# Altium project My_Forecaster.PrjPcb
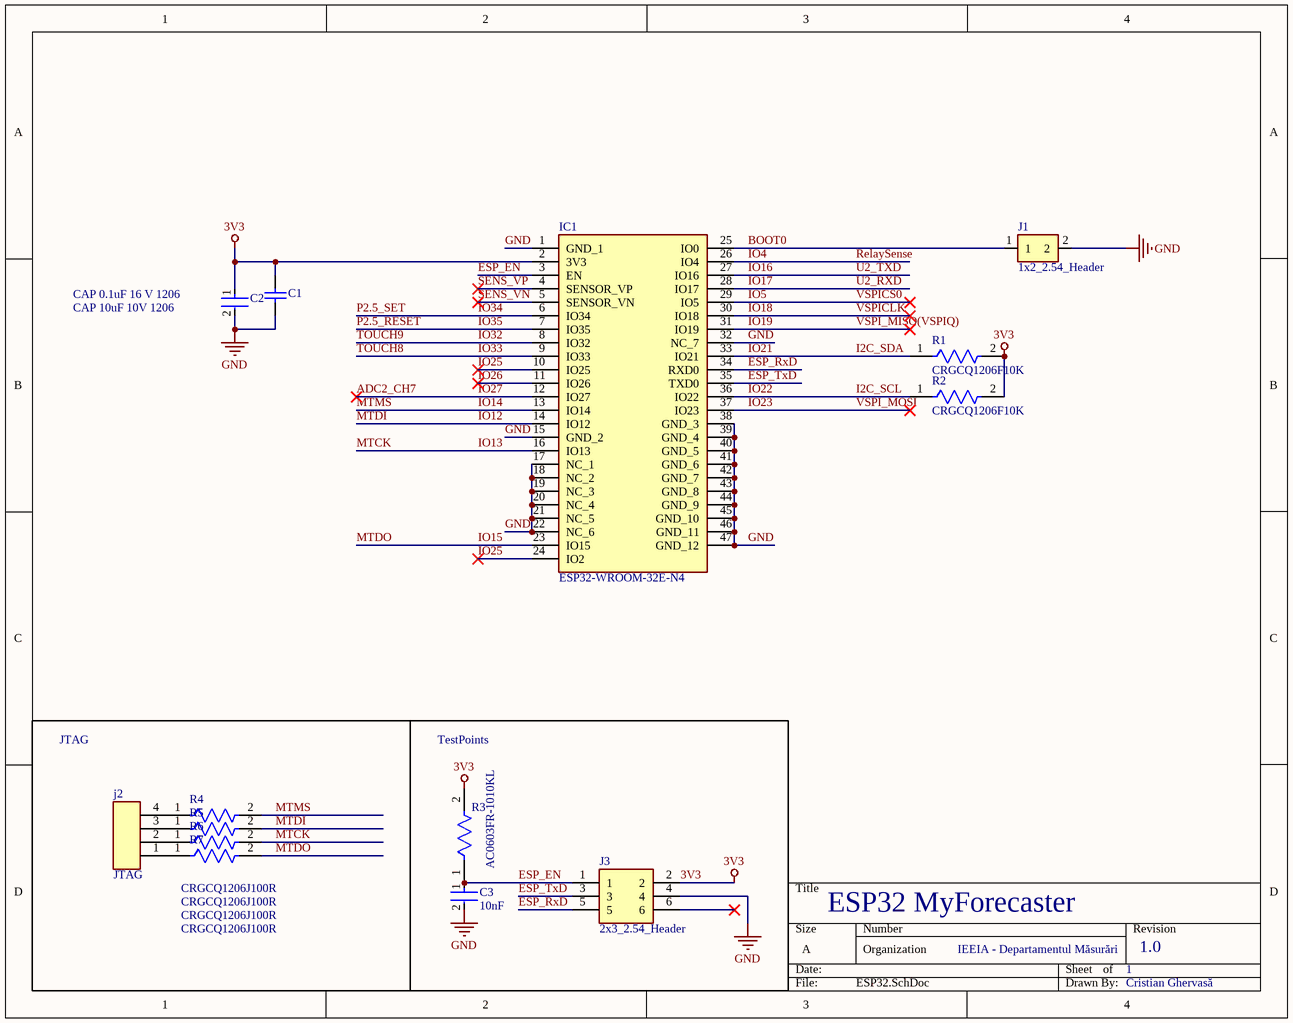
[diagram p0: ESP32.SchDoc]
Revision: 1.0; Organization: IEEIA - Departamentul Măsurări; DrawnBy: Cristian Ghervasă
4 sheets, 41 parts. Net scope: global (net labels, ports and power ports of the same name join across sheets).
Board file: My_Forecaster.PcbDoc
Sheets:
  ESP32.SchDoc
  Communication.SchDoc
  Battery_Circuit.SchDoc
  PowerPlant.SchDoc

## Sheet ESP32.SchDoc
size A; SheetNumber: 1; SheetTotal: 4

### Parts
C1  CAP 10uF 10V 1206  [CAPC1206(3216)190_N]
C2  CAP 0.1uF 16 V 1206  [FP-C1206C-EB-MFG]
C3  10nF  [FP-CL10-IPC_B]
IC1  ESP32-WROOM-32E-N4  [ESP32WROOM32EN4]
J1  1x2_2.54_Header  [1x2_2.54_Header]
j2  JTAG  [1x4_2.54_Header]
J3  2x3_2.54_Header  [2x3_2.54_Header]
R1  CRGCQ1206F10K  [FP-CRGCQ1206-IPC_C]
R2  CRGCQ1206F10K  [FP-CRGCQ1206-IPC_C]
R3  AC0603FR-1010KL  [FP-AC0603-IPC_B]
R4  CRGCQ1206J100R  [FP-CRGCQ1206-IPC_C]
R5  CRGCQ1206J100R  [FP-CRGCQ1206-IPC_C]
R6  CRGCQ1206J100R  [FP-CRGCQ1206-IPC_C]
R7  CRGCQ1206J100R  [FP-CRGCQ1206-IPC_C]

### Blocks framed on the sheet
JTAG: j2 R4-R7

### Nets
3V3: C1.2 C2.1 IC1.2(3V3) J3.2 R1.2 R2.2 R3.2
GND: C1.1 C2.2 C3.2 IC1.1(GND_1) IC1.15(GND_2) IC1.17(NC_1) IC1.18(NC_2) IC1.19(NC_3) IC1.20(NC_4) IC1.21(NC_5) IC1.22(NC_6) IC1.32(NC_7) IC1.38(GND_3) IC1.39(GND_4) IC1.40(GND_5) IC1.41(GND_6) IC1.42(GND_7) IC1.43(GND_8) IC1.44(GND_9) IC1.45(GND_10) IC1.46(GND_11) IC1.47(GND_12) J1.2 J3.4
ADC2_CH7: IC1.12(IO27)  [also labelled IO27]
BOOT0: IC1.25(IO0) J1.1
ESP_EN: C3.1 IC1.3(EN) J3.1 R3.1
ESP_RxD: IC1.34(RXD0) J3.5
ESP_TxD: IC1.35(TXD0) J3.3
I2C_SCL: IC1.36(IO22) R2.1  [also labelled IO22]
I2C_SDA: IC1.33(IO21) R1.1  [also labelled IO21]
IO4: IC1.26(IO4)  [also labelled RelaySense]
IO5: IC1.29(IO5)  [also labelled VSPICS0]
IO12: IC1.14(IO12) R5.2  [also labelled MTDI]
IO13: IC1.16(IO13) R6.2  [also labelled MTCK]
IO14: IC1.13(IO14) R4.2  [also labelled MTMS]
IO15: IC1.23(IO15) R7.2  [also labelled MTDO]
IO16: IC1.27(IO16)  [also labelled U2_TXD]
IO17: IC1.28(IO17)  [also labelled U2_RXD]
IO18: IC1.30(IO18)  [also labelled VSPICLK]
IO19: IC1.31(IO19)  [also labelled VSPI_MISO(VSPIQ)]
IO23: IC1.37(IO23)  [also labelled VSPI_MOSI]
IO25: IC1.10(IO25) IC1.24(IO2)
IO26: IC1.11(IO26)
IO32: IC1.8(IO32)  [also labelled TOUCH9]
IO33: IC1.9(IO33)  [also labelled TOUCH8]
IO34: IC1.6(IO34)  [also labelled P2.5_SET]
IO35: IC1.7(IO35)  [also labelled P2.5_RESET]
SENS_VN: IC1.5(SENSOR_VN)
SENS_VP: IC1.4(SENSOR_VP)
Netj2_1: j2.1 R7.1
Netj2_2: j2.2 R6.1
Netj2_3: j2.3 R5.1
Netj2_4: j2.4 R4.1

Not connected (* = marked no-connect by the designer): J3 6*

### Notes on the sheet
- TestPoints
- ESP32 MyForecaster
- Organization

### Library data of the parts
C1 = CMP-1037-04966-1: CAP 10uF 10V ±5% 1206 (3216 Metric) Thickness 1.9mm SMD; Case-Metric: 3216; Case-EIA: 1206; Tolerance: Â±5%; Max Thickness: 1.9 mm; Value: 10uF; Rated Voltage: 10 V; Technology: SMT
C2 = CMP-03020-018021-2: C1206 0.10 μF X7R 10.00% 16 V; Manufacturer Part Number: C1206C104K4RACAUTO; Manufacturer: KEMET; Automotive Grade: Grade 0; Tolerance: 0.1; Temperature Coefficient: 15%; Material: Ceramic; Capacitance: 0.10 μF; Value: 0.10 μF; Voltage Rating: 16 V; Package: C1206C-EB; Device Class L2: Capacitors; ComponentLink2URL: https://content.kemet.com/datasheets/KEM_C1007_X8R_ULTRA_150C_SMD.pdf; RoHS: TRUE; Height: 0.88mm; Device Class L1: Passive Components; Temperature Range Low: -55°C; Category: Cap; Octopart: https://octopart.com/c1206c104k4racauto-kemet-95437231; Lead Free: Yes; Temperature Characteristic: X7R; Temperature Range High: +150°C; Device Class L3: Ceramic Capacitors; Temperature: -55°C to +150°C; Ipc Land Pattern Name: CAPC320160X78; Automotive: Yes; ComponentLink2Description: Datasheet
C3 = CMP-13271-004285-1: Cap Ceramic 10nF 25V X7R ±10% Pad SMD 0603 +125°C T/R; Voltage: 50V; Height: 0.8mm; Tolerance: 10%; Package Quantity: 4000; Width: 0.031inch; Case/Package: 0603; Thickness: 0.035inch; Capacitance: 10nF; Packaging: Tape and Reel; Min Operating Temperature: -55°C; RoHS Compliant: Yes; Voltage Rating: 25V; Case Code (Imperial): 0603; Radiation Hardening: No; Depth: 0.8mm; Series: CL; Contact Plating: Tin; Mount: Surface Mount; Construction: Flat; Case Code (Metric): 1608; Length: 1.6mm; Max Operating Temperature: 125°C; Dielectric: X7R
IC1 = ESP32-WROOM-32E-N4: Integrated Circuit; Manufacturer_Name: Espressif Systems; Datasheet Link: https://www.espressif.com/sites/default/files/documentation/esp32-wroom-32e_esp32-wroom-32ue_datasheet_en.pdf; Height: 3.25mm; Manufacturer_Part_Number: ESP32-WROOM-32E-N4; Mouser Part Number: 356-ESP32WRM32E132PH; Mouser Price/Stock: https://www.mouser.co.uk/ProductDetail/Espressif-Systems/ESP32-WROOM-32E-N4?qs=Li%252BoUPsLEnsPzTWsi%252BRMgQ%3D%3D
J1 = 1x2_2.54_Header: Connector
j2 = 1x4_2.54_Header: Connector
J3 = 2x3_2.54_Header: Connector; Manufacturer_Name: TE Connectivity; Manufacturer_Part_Number: 5-146254-3; Datasheet Link: https://4donline.ihs.com/images/VipMasterIC/IC/TYEL/TYEL-S-A0002895876/TYEL-S-A0002895876-1.pdf?hkey=52A5661711E402568146F3353EA87419; Height: 8.21mm; Mouser Part Number: 571-5-146254-3; Mouser Price/Stock: https://www.mouser.co.uk/ProductDetail/TE-Connectivity/5-146254-3?qs=bwpFY26eRVeBoCoMAqhLNw%3D%3D; Arrow Part Number: 5-146254-3; Arrow Price/Stock: https://www.arrow.com/en/products/5-146254-3/te-connectivity?utm_currency=USD&region=nac
R1 R2 = CMP-03211-010884-1: CRGCQ1206 10KΩ 0.25W 1% ±100ppm/°C 200V; Manufacturer: TE Connectivity; Tolerance: 0.01; Automotive Grade: Grade 913; Value: 10KΩ; Automotive: Yes; Temperature: -55°C to +155°C; RoHS: TRUE; Series: CRGCQ; Lead Free: Yes; Device Class L3: Chip SMD Resistors; Package: CRGCQ1206; ComponentLink2URL: https://www.te.com/commerce/DocumentDelivery/DDEController?Action=showdoc&DocId=Data+Sheet%7F1773204-3%7F1%7Fpdf%7FEnglish%7FENG_DS_1773204-3_1.pdf%7F4-2176347-922; Ipc Land Pattern Name: RESC310155X55; Composition: Thick Film; Voltage Rating: 200V; Device Class L1: Passive Components; Temperature Range Low: -55°C; Resistance: 10KΩ; Height: 0.65mm; Power Rating: 0.25W; Device Class L2: Resistors; Temperature Range High: +155°C; Octopart: https://octopart.com/crgcq1206f10k-te+connectivity-91018244; Ambient Temperature Range High: +70°C; ComponentLink2Description: Datasheet; Temperature Coefficient: ±100ppm/°C; Manufacturer Part Number: CRGCQ1206F10K; Category: Res
R3 = CMP-03412-017743-2: RES 10KΩ 1.00% 0.1W 0603; Tolerance: 1%; Resistance: 10kR; Voltage Rating: 50V; Temperature Coefficient: 100ppm/°C; Power Rating: 100mW; RoHS Compliant: Yes; Max Operating Temperature: 155°C; Min Operating Temperature: -55°C; Width: 0.8mm; Packaging: Tape and Reel; Height: 0.45mm; Termination: SMD/SMT; Length: 1.6mm; Weight: 7.1E-05oz; Case Code (Imperial): 0603; Case Code (Metric): 1608; Series: AC; Case/Package: 0603
R4-R7 = CMP-03211-011244-1: CRGCQ1206 100Ω 0.25W 5% ±200ppm/°C 200V; Manufacturer: TE Connectivity; Automotive Grade: Grade 458; Tolerance: 0.05; Temperature: -55°C to +155°C; Device Class L3: Chip SMD Resistors; Power Rating: 0.25W; ComponentLink2URL: https://www.te.com/commerce/DocumentDelivery/DDEController?Action=showdoc&DocId=Data+Sheet%7F1773204-3%7F1%7Fpdf%7FEnglish%7FENG_DS_1773204-3_1.pdf%7F4-2176347-467; Temperature Range Low: -55°C; Automotive: Yes; Lead Free: Yes; Voltage Rating: 200V; Device Class L2: Resistors; Height: 0.65mm; ComponentLink2Description: Datasheet; Ipc Land Pattern Name: RESC310155X55; Category: Res; RoHS: TRUE; Temperature Coefficient: ±200ppm/°C; Octopart: https://octopart.com/crgcq1206j100r-te+connectivity-91018304; Value: 100Ω; Manufacturer Part Number: CRGCQ1206J100R; Ambient Temperature Range High: +70°C; Device Class L1: Passive Components; Temperature Range High: +155°C; Package: CRGCQ1206; Composition: Thick Film; Series: CRGCQ; Resistance: 100Ω

## Sheet Communication.SchDoc
size A; SheetNumber: 2; SheetTotal: 4
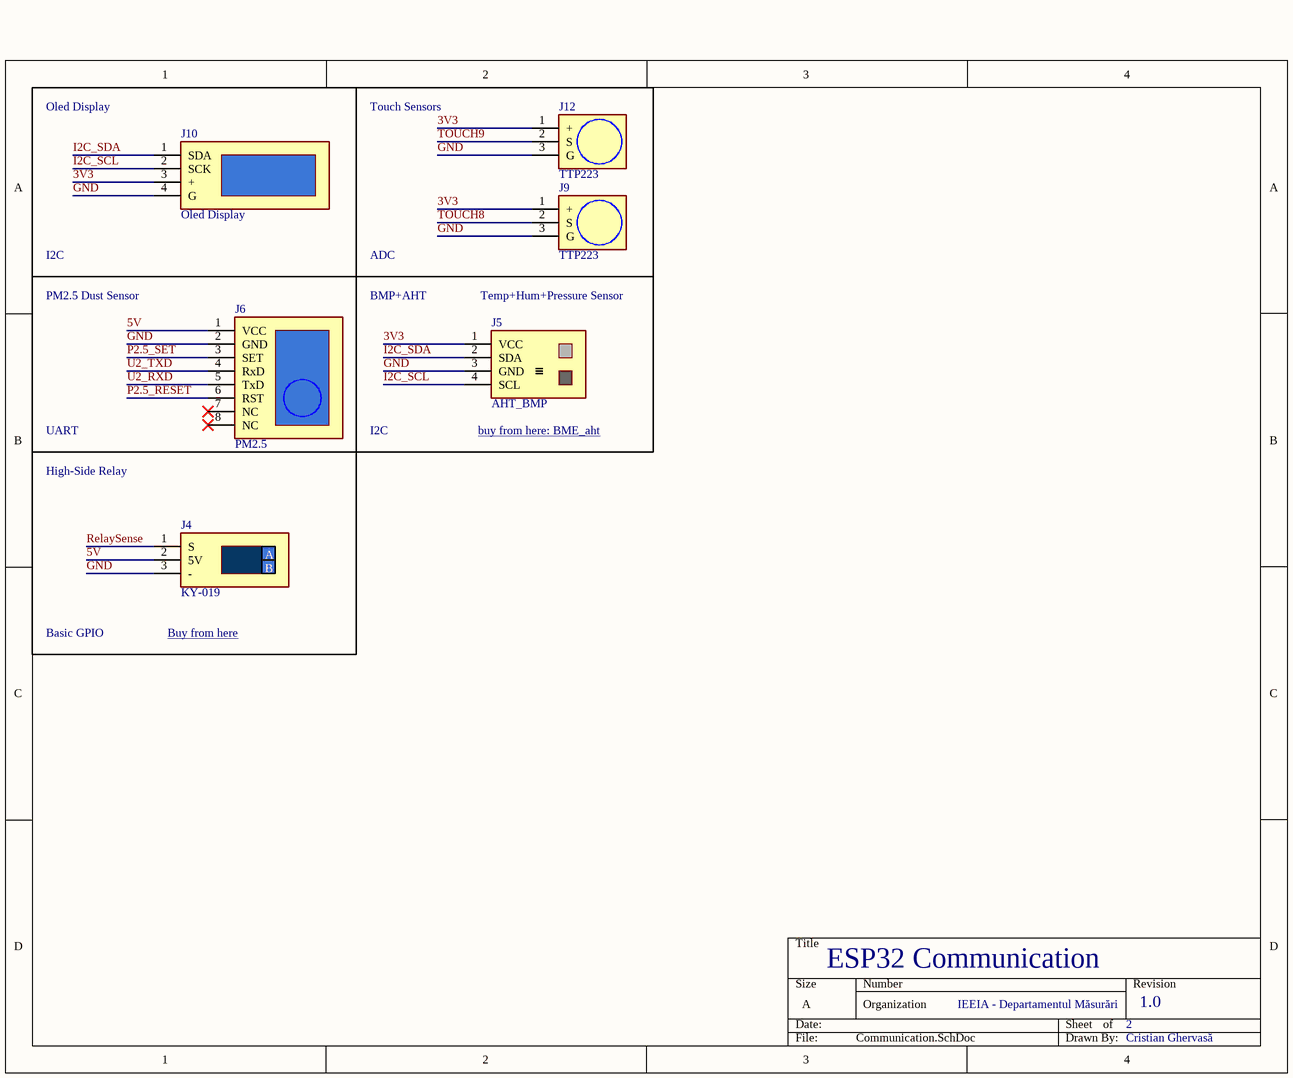
[diagram p1: Communication.SchDoc]

### Parts
J4  KY-019  [KY-019]
J5  AHT_BMP  [BMP280_AHT20]
J6  PM2.5  [PM2.5]
J9  TTP223  [TTP223_Sensor]
J10  Oled Display  [OLED_0.91_128x32]
J12  TTP223  [TTP223_Sensor]

### Nets
3V3: J5.1(VCC) J9.1(+) J10.3(+) J12.1(+)
5V: J4.2(5V) J6.1(VCC)
GND: J4.3(-) J5.3(GND) J6.2(GND) J9.3(G) J10.4(G) J12.3(G)
I2C_SCL: J5.4(SCL) J10.2(SCK)
I2C_SDA: J5.2(SDA) J10.1(SDA)
P2.5_RESET: J6.6(RST)  [project net IO35]
P2.5_SET: J6.3(SET)  [project net IO34]
RelaySense: J4.1(S)  [project net IO4]
TOUCH8: J9.2(S)  [project net IO33]
TOUCH9: J12.2(S)  [project net IO32]
U2_RXD: J6.5(TxD)  [project net IO17]
U2_TXD: J6.4(RxD)  [project net IO16]

Not connected (* = marked no-connect by the designer): J6 7(NC)* 8(NC)*

### Notes on the sheet
- Oled Display
- Touch Sensors
- I2C
- ADC
- PM2.5 Dust Sensor
- BMP+AHT                  Temp+Hum+Pressure Sensor
- High-Side Relay
- UART
- (near J5) buy from here: BME_aht <https://www.aliexpress.com/item/1005009630154976.html?spm=a2g0o.productlist.main.15.1ae4155cFHiNRk&algo_pvid=f758ec4f-2f62-40d7-a79f-4fe52f6579c2&pdp_ext_f=%7B%22order%22%3A%22133%22%2C%22eval%22%3A%221%22%2C%22fromPage%22%3A%22search%22%7D&utparam-url=scene%3Asearch%7Cquery_from%3A%7Cx_object_id%3A1005009630154976%7C_p_origin_prod%3A>
- Basic GPIO
- Buy from here <https://www.aliexpress.com/item/1005001827673469.html?spm=a2g0o.productlist.main.4.4c76a648lQAvU0&aem_p4p_detail=202605060420433784476564820970008209055&algo_pvid=ab14cfe4-ab42-4551-af76-a0fe1d7bf99c&pdp_ext_f=%7B%22order%22%3A%221415%22%2C%22eval%22%3A%221%22%2C%22fromPage%22%3A%22search%22%7D&utparam-url=scene%3Asearch%7Cquery_from%3A%7Cx_object_id%3A1005001827673469%7C_p_origin_prod%3A&search_p4p_id=202605060420433784476564820970008209055_1#nav-specification>
- ESP32 Communication
- Organization
- (in symbol KY-019) A; B

### Library data of the parts
J4 = KY-019: High-Side Relay
J5 = AHT_BMP: BMP280+AHT20. Temp+Humidity+Pressure.
J6 = PM2.5: Dust Sensor
J9 J12 = TTP223: Touch Sensor
J10 = OLED_0.91_128x32

## Sheet Battery_Circuit.SchDoc
size A; SheetNumber: 3; SheetTotal: 4
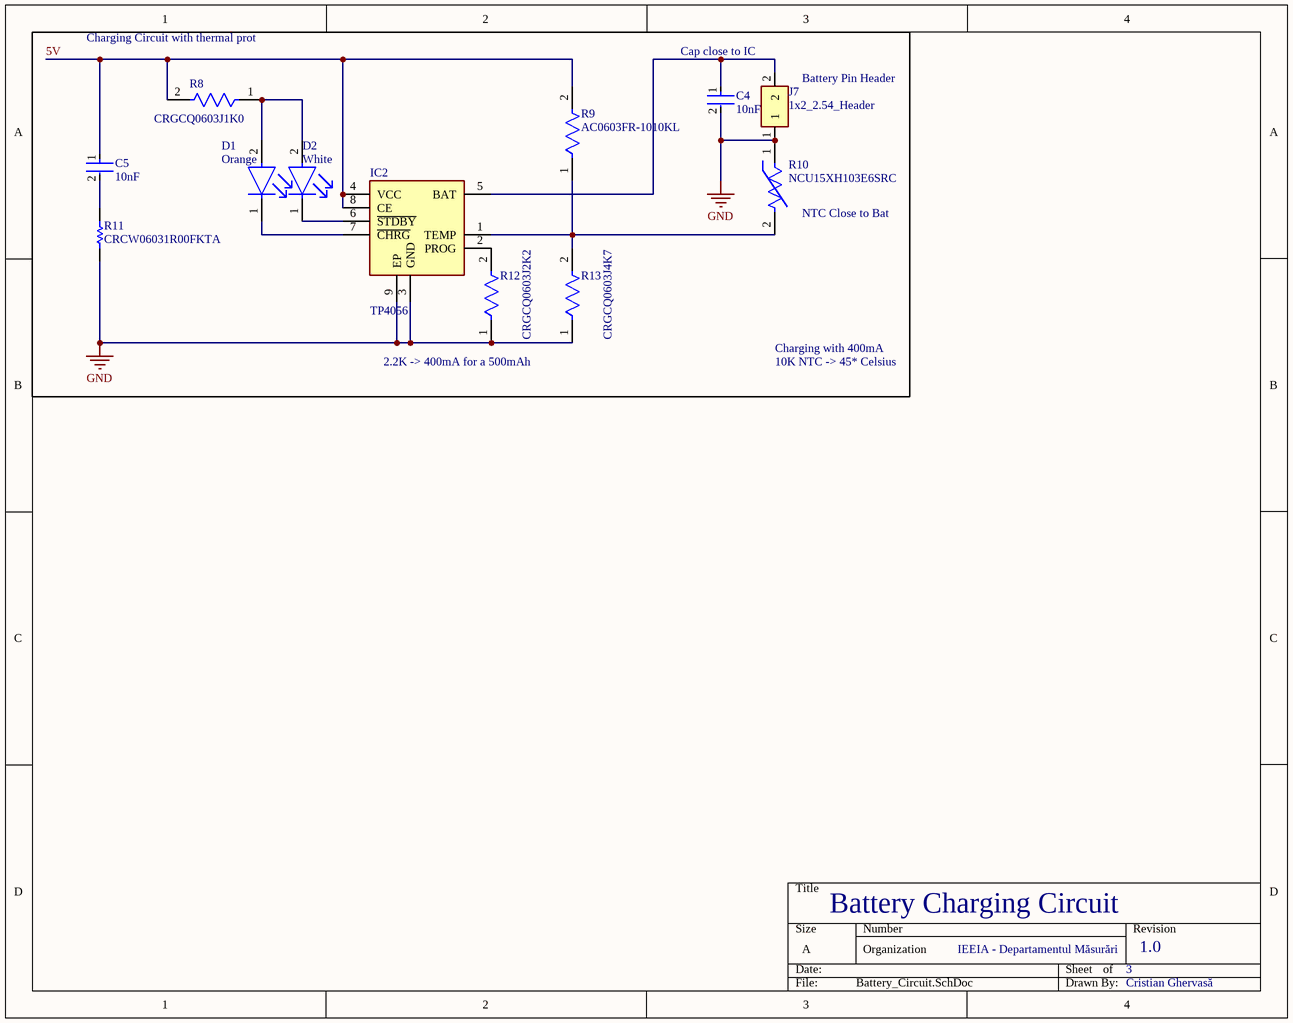
[diagram p2: Battery_Circuit.SchDoc]

### Parts
C4  10nF  [FP-CL10-IPC_C]
C5  10nF  [FP-CL10-IPC_C]
D1  Orange  [FP-LTST-C190KFKT-MFG]
D2  White  [FP-6_541-5091_01-4-MFG]
IC2  TP4056  [SOIC127P600X175-9N]
J7  1x2_2.54_Header  [1x2_2.54_Header]
R8  CRGCQ0603J1K0  [FP-CRGCQ0603-IPC_C]
R9  AC0603FR-1010KL  [FP-AC0603-IPC_B]
R10  NCU15XH103E6SRC  [FP-NCP15-NCU15-0_05-IPC_A]
R11  CRCW06031R00FKTA  [RESC1609X50X30NL10T20]
R12  CRGCQ0603J2K2  [FP-CRGCQ0603-IPC_C]
R13  CRGCQ0603J4K7  [FP-CRGCQ0603-IPC_C]

### Nets
5V: C5.1 IC2.4(VCC) IC2.8(CE) R8.2 R9.2
GND: C4.2 IC2.3(GND) IC2.9(EP) J7.1 R10.1 R11.1 R12.1 R13.1
NetC4_1: C4.1 IC2.5(BAT) J7.2
NetC5_2: C5.2 R11.2
NetD1_1: D1.1(C) IC2.7(~{CHRG})
NetD1_2: D1.2(A) D2.2(A) R8.1
NetD2_1: D2.1(C) IC2.6(~{STDBY})
NetIC2_1: IC2.1(TEMP) R9.1 R10.2 R13.2
NetIC2_2: IC2.2(PROG) R12.2

### Notes on the sheet
- Charging Circuit with thermal prot
- Cap close to IC
- (near J7) Battery Pin Header
- (near R10) NTC Close to Bat
- 2.2K -> 400mA for a 500mAh
- Charging with 400mA
- 10K NTC -> 45* Celsius
- Battery Charging Circuit
- Organization

### Library data of the parts
C4 C5 = CMP-13271-004285-1: as C3 on sheet ESP32; Height: 0.8mm; Tolerance: 10%; Package Quantity: 4000; Width: 0.031inch; Case/Package: 0603; Thickness: 0.035inch; Capacitance: 10nF; Packaging: Tape and Reel; Min Operating Temperature: -55°C; RoHS Compliant: Yes; Voltage Rating: 25V; Case Code (Imperial): 0603; Radiation Hardening: No; Depth: 0.8mm; Series: CL; Contact Plating: Tin; Mount: Surface Mount; Construction: Flat; Case Code (Metric): 1608; Length: 1.6mm; Max Operating Temperature: 125°C; Dielectric: X7R
D1 = CMP-1674-00008-9: LED ORANGE CLEAR CHIP SMD; Luminous Intensity: 90mcd; Viewing Angle: 130°; Wavelength: 611nm; Lens Color: Colorless; Test Current: 20mA; Lens Style: Flat; Reverse Voltage: 5V; Power Dissipation: 75mW; Number of Elements: 1; Forward Current: 30mA; Lens Size: 0.8mm; Dominant Wavelength: 605nm; Forward Voltage: 2V; Min Operating Temperature: -55°C; Lens Transparency: Clear; RoHS Compliant: Yes; Case Code (Metric): 1608; Color: Orange; Width: 0.8mm; Number of Pins: 2; Depth: 1.6mm; Case/Package: 0603; Radiation Hardening: No; Case Code (Imperial): 0603; Max Operating Temperature: 85°C; Number of LEDs: 1; Height: 0.9mm; Mount: Surface Mount; Packaging: Tape and Reel; Length: 3.2mm; Package Quantity: 3000; Power Rating: 75mW; Lead Free: Lead Free; Illumination Color: Orange; Series: -
D2 = CMP-02520-000007-1: LED COOL WHITE 0603 SMD; Manufacturer: Vishay; Manufacturer Part Number: VLMW1300-GS08; Viewing Angle: 130°; Forward Voltage: 3.15V; Luminous Intensity: 180mcd; Forward Current: 5mA; Led Orientation: Top View; Power Dissipation: 70mW; Category: Diode; Device Class L2: LEDs; Device Class L1: Optoelectronics; ComponentLink2URL: http://www.vishay.com/docs/82435/vlmw1300.pdf; Octopart: https://octopart.com/vlmw1300-gs08-vishay-21709203; Mouser Description: LED; SMD; 0603; white cold; 45-180mcd; 7000(typ)K; 130°; 5mA; Automotive: No; Ambient Temperature Range High: +80°C; Colour: White; Device Class L3: unset; Temperature Range High: +80°C; Height: 0.75mm; Package: 6.541-5091.01-4; RoHS: TRUE; Digikey Description: LED COOL WHITE 0603 SMD; Lead Free: Yes; Ambient Temperature Range Low: -20°C; ComponentLink2Description: Datasheet; Temperature Range Low: -20°C; Temperature: -20°C to +80°C
IC2 = TP4056: Integrated Circuit; Manufacturer_Name: TPOWER; Datasheet Link: https://pdf1.alldatasheet.com/datasheet-pdf/download/1133270/TPOWER/TP4056.html; Height: 1.75mm; Manufacturer_Part_Number: TP4056
J7 = 1x2_2.54_Header: Connector
R8 = CMP-03211-006828-1: CRGCQ 0603 1K0 5%; Manufacturer: TE Connectivity; Resistance: 1KΩ; Temperature Coefficient: ±100ppm/°C; Value: 1KΩ; Tolerance: 0.05; Power Rating: 0.1W; Voltage Rating: 75V; Temperature: -55°C to +155°C; Height: 0.55mm; Lead Free: Yes; Device Class L1: Passive Components; Manufacturer Part Number: CRGCQ0603J1K0; Device Class L3: Chip SMD Resistors; Series: CRGCQ; Octopart: https://octopart.com/crgcq0603j1k0-te+connectivity-91018104; Category: Res; RoHS: TRUE; Temperature Range High: +155°C; Digikey Description: CRGCQ 0603 1K0 5%; Ambient Temperature Range High: +70°C; ComponentLink2Description: Datasheet; Device Class L2: Resistors; Package: CRGCQ0603; Ipc Land Pattern Name: RESC16080X45; Temperature Range Low: -55°C; ComponentLink2URL: https://www.te.com/commerce/DocumentDelivery/DDEController?Action=showdoc&DocId=Data+Sheet%7F1773204-3%7F1%7Fpdf%7FEnglish%7FENG_DS_1773204-3_1.pdf%7F4-2176339-695; Composition: Thick Film
R9 = CMP-03412-017743-2: as R3 on sheet ESP32; RoHS Compliant: Yes; Max Operating Temperature: 155°C; Min Operating Temperature: -55°C; Width: 0.8mm; Packaging: Tape and Reel; Height: 0.45mm; Termination: SMD/SMT; Length: 1.6mm; Weight: 7.1E-05oz; Case Code (Imperial): 0603; Case Code (Metric): 1608; Series: AC; Case/Package: 0603
R10 = CMP-06022-000214-2: NTC Thermistor for Temperature Sensor, Automotive, 0402, 10kΩ, 3%, 0.1mA, 5V; RoHS Compliant: Yes
R11 = CMP-2000-03048-1: 1OHM; Manufacturer: Vishay Dale; Part Number: CRCW06031R00FKTA
R12 = CMP-03211-007977-1: CRGCQ0603 2.2KΩ 5% ±100ppm/°C 75V; Manufacturer: TE Connectivity; Power Rating: 0.1W; Tolerance: 0.05; RoHS: TRUE; Manufacturer Part Number: CRGCQ0603J2K2; Device Class L1: Passive Components; Package: CRGCQ0603; Resistance: 2.2KΩ; Category: Res; Value: 2.2KΩ; Temperature Range Low: -55°C; Device Class L3: Chip SMD Resistors; Temperature Coefficient: ±100ppm/°C; Ambient Temperature Range High: +70°C; Temperature Range High: +155°C; Composition: Thick Film; Height: 0.55mm; ComponentLink2URL: https://www.te.com/commerce/DocumentDelivery/DDEController?Action=showdoc&DocId=Data+Sheet%7F1773204-3%7F1%7Fpdf%7FEnglish%7FENG_DS_1773204-3_1.pdf%7F4-2176339-767; Device Class L2: Resistors; Voltage Rating: 75V; Octopart: https://octopart.com/crgcq0603j2k2-te+connectivity-91018114; ComponentLink2Description: Datasheet; Series: CRGCQ; Lead Free: Yes; Ipc Land Pattern Name: RESC16080X45; Temperature: -55°C to +155°C
R13 = CMP-03211-000648-1: CRGCQ 0603 4K7 5%; Manufacturer: TE Connectivity; Tolerance: 0.05; Temperature Coefficient: ±100ppm/°C; Voltage Rating: 75V; Power Rating: 0.1W; Value: 4.7KΩ; ComponentLink2URL: https://www.te.com/commerce/DocumentDelivery/DDEController?Action=showdoc&DocId=Data+Sheet%7F1773204-3%7F1%7Fpdf%7FEnglish%7FENG_DS_1773204-3_1.pdf%7F4-2176339-847; Device Class L3: Chip SMD Resistors; Ipc Land Pattern Name: RESC16080X45; Digikey Description: CRGCQ 0603 4K7 5%; Temperature Range Low: -55°C; Octopart: https://octopart.com/crgcq0603j4k7-te+connectivity-91018128; RoHS: TRUE; Lead Free: Yes; Mouser Description: Res Thick Film 0603 4.7K Ohm 5% 0.1W(1/10W) ±100ppm/C Pad SMD Automotive T/R; Category: Res; ComponentLink2Description: Datasheet; Temperature: -55°C to +155°C; Device Class L2: Resistors; Temperature Range High: +155°C; Ambient Temperature Range High: +70°C; Composition: Thick Film; Height: 0.55mm; Series: CRGCQ; Package: CRGCQ0603; Manufacturer Part Number: CRGCQ0603J4K7; Resistance: 4.7KΩ; Device Class L1: Passive Components

## Sheet PowerPlant.SchDoc
size A; SheetNumber: 4; SheetTotal: 4
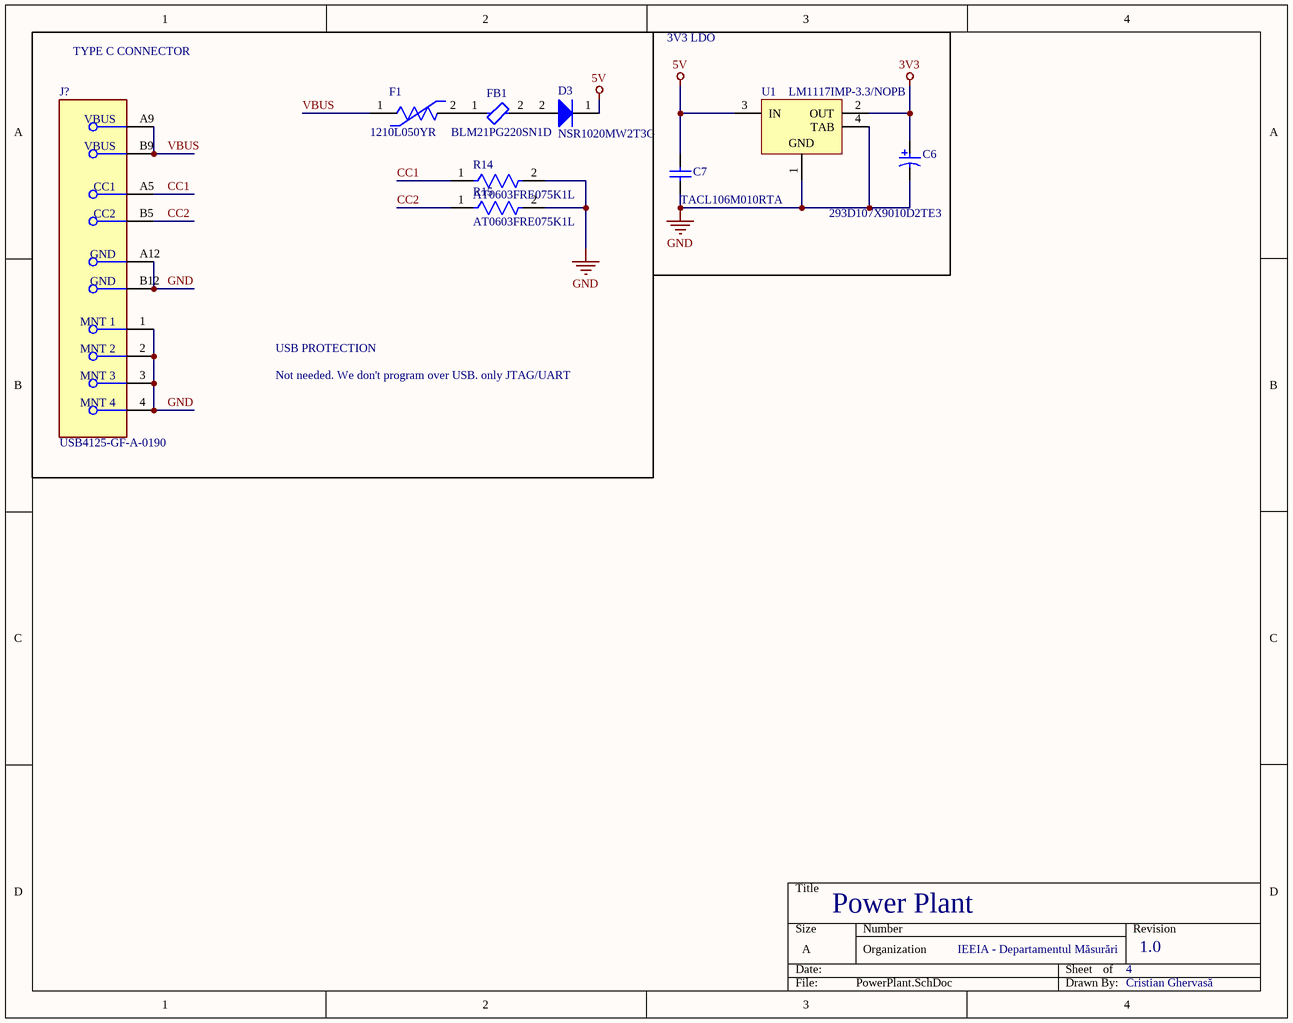
[diagram p3: PowerPlant.SchDoc]

### Parts
C6  293D107X9010D2TE3  [VISH-7343-31_N]
C7  TACL106M010RTA  [CAPC1609X100X15NL20]
D3  NSR1020MW2T3G  [ONSC-SOD-323-2-477-02_V]
F1  1210L050YR  [FP-1210L050YR-MFG]
FB1  BLM21PG220SN1D  [FP-BLM21-0_2-t0_85-e0_5-MFG]
J?  USB4125-GF-A-0190  [FP-USB4125-GF-A-0190-MFG]
R14  AT0603FRE075K1L  [FP-AT0603-IPC_B]
R15  AT0603FRE075K1L  [FP-AT0603-IPC_B]
U1  LM1117IMP-3.3/NOPB  [DCY0004A_N]

### Nets
3V3: C6.1 U1.2(OUT)
5V: C7.2 D3.1(K) U1.3(IN)
GND: C6.2 C7.1 J?.1(MNT_1) J?.2(MNT_2) J?.3(MNT_3) J?.4(MNT_4) J?.A12(GND) J?.B12(GND) R14.2 R15.2 U1.1(GND) U1.4(TAB)
CC1: J?.A5(CC1) R14.1
CC2: J?.B5(CC2) R15.1
VBUS: F1.1 J?.A9(VBUS) J?.B9(VBUS)
NetD3_2: D3.2(A) FB1.2
NetF1_2: F1.2 FB1.1

### Notes on the sheet
- TYPE C CONNECTOR
- 3V3 LDO
- USB PROTECTION
- Not needed. We don't program over USB. only JTAG/UART
- Power Plant
- Organization

### Library data of the parts
C6 = CMP-1666-00024-1: Solid Tantalum Chip Capacitor, 100 uF, +/- 10%, 10 V, -55 to 125 degC, 2917 (7343 Metric), RoHS, Tape and Reel; Voltage Rating (DC): 50 V; Case\Package: 0603; Resistance: 1.2 kohm; Power Rating: 100 mW; Tolerance: 1%; ComponentLink2URL: http://www.vishay.com/docs/40002/293d.pdf; Max Operating Temperature: 155 degC; Length: 1.6 mm; Mount: Surface Mount; Pins: 2; RoHSCompliant: true; ComponentLink1URL: http://www.vishay.com/; DatasheetVersion: Aug-16; REACH SVHC: No SVHC; Height: 0.45 mm; Width: 0.8 mm; Min Operating Temperature: -55 degC; ComponentLink2Description: Datasheet; Case Code (Metric): 1608; Case Code (Imperial): 0603; Packaging: Tape and Reel; PackageReference: 7343-31; Package Quantity: 200; Voltage Rating: 50 V; PackageDescription: 2-Pin Surface Mount Device, Body 7.3 x 4.3 mm; ComponentLink1Description: Manufacturer URL
C7 = CMP-2006-00192-1: Manufacturer: AVX Interconnect / Elco; Part Number: TACL106M010RTA
D3 = CMP-1055-00469-1: Schottky Barrier Diode, 2-Pin SOD-323, Pb-Free, Tape and Reel; Manufacturer: On Semiconductor; IFSM Max (A): 5; Configuration: Single; PartNumber: NSR1020MW2T3G; RoHS: TRUE; ComponentLink2Description: Datasheet; PackageVersion: Rev. H, 03/2007; ComponentLink3Description: Package Specification; ComponentLink1Description: Manufacturer URL; DatasheetVersion: Rev. 1; PackageDescription: 2-Pin SOD, Body 1.7 x 1.25 mm; ComponentLink2URL: http://www.onsemi.cn/pub_link/Collateral/NSR1020MW2T1-D.PDF; Packing: Tape and Reel; ComponentLink3URL: http://www.onsemi.com/pub_link/Collateral/477-02.PDF.1; PackageReference: SOD-323-2-477-02; ComponentLink1URL: http://www.onsemi.com/; Mounting Technology: Surface Mount
F1 = CMP-08606-000067-1: PTC RESET FUSE 13.2V 500MA 1210; Approvals: cULus; Resistance: 900mR; Time to Trip: 0.1s; Max Current Rating: 100A; Trip Current: 1A; Max Power Dissipation: 600mW; Case Code (Metric): 3225; Min Operating Temperature: -40°C; Max Voltage Rating (DC): 13.2V; Hold Current: 500mA; Working Voltage: 13.2V; Termination: SMD/SMT; Case Code (Imperial): 1210; Current Rating: 100A; REACH SVHC: No SVHC; Width: 2.8mm; Lead Free: Lead Free; Length: 3.43mm; Voltage Rating (DC): 13.2V; Packaging: Tape and Reel; Terminal Material: Copper; Voltage Rating: 13.2V; Height: 0.85mm; Case/Package: 1210; Package Quantity: 4000; Max Operating Temperature: 85°C; Power Dissipation: 600mW; Operating Supply Voltage: 13.2V
FB1 = CMP-0686-00622-4: Chip Ferrite Bead, 0805, 22Ω @ 100MHz, 0.009Ω, 25%, 6A; Manufacturer Series: BLM21P; Resistance: 10mR; DC Resistance-Max: 9mR; Material: Steel; Number of Circuits: 1; Impedance: 22R; Shielding: Unshielded; DC Current: 6A; Termination: SMD/SMT; Max Operating Temperature: 125°C; Case Code (Metric): 2012; Radiation Hardening: No; Length: 2mm; Case Code (Imperial): 0805; RoHS Compliant: Yes; Max Current Rating: 6A; DC Resistance (DCR): 9mR; Case/Package: 0805; Core Material: Ferrite; Width: 1.25mm; Weight: 0.000194oz; Number of Pins: 2; Packaging: Tape and Reel; REACH SVHC: No SVHC; Tolerance: 25%; Height: 0.85mm; Number of Functions: 1; Lead Free: Lead Free; Terminal Finish: Tin; Number of Lines: 1; Package Quantity: 1; Series: BLM21P; Test Frequency: 100MHz; Min Operating Temperature: -55°C; Max DC Current: 6A; Current Rating: 6A; Depth: 1.25mm
J? = CMP-245163-000004-1: CONN RCPT TYPE C 6P SMD RA
R14 R15 = CMP-03412-047308-1: Thin Film Chip Resistors Automotive Grade 5.1kΩ 1% 50ppm/°C 0603
U1 = CMP-0062-01631-4: 800mA Low-Dropout Linear Regulator, 4-pin SOT-223, Pb-Free; Manufacturer: Texas Instruments; PackageTopMarking: XYTT*N05B; PowerWise: N; High-Reliability: Y; CompType: LDO IC; Code_IPC: SOT223-4; PackageReference: DCY0004A; PinCount: 4; PackageDescription: Molded SOT-223, 6.50 x 3.56 x 1.6mm Body, 4 Lead, 2.3mm Pitch; PartNumber: LM1117IMP-3.3/NOPB; RoHS: Y; ComponentLink1Description: Datasheet URL; Code_JEDEC: TO-261-AA; ComponentLink1URL: http://www.ti.com/general/docs/lit/getliterature.tsp?genericPartNumber=LM1117-N&fileType=pdf

## Nets that join several sheets
3V3: ESP32 (7 pins), Communication (J5.1 J9.1 J10.3 J12.1), PowerPlant (C6.1 U1.2)
5V: Communication (J4.2 J6.1), Battery_Circuit (5 pins), PowerPlant (C7.2 D3.1 U1.3)
GND: ESP32 (24 pins), Communication (6 pins), Battery_Circuit (8 pins), PowerPlant (12 pins)
I2C_SCL: ESP32 (IC1.36 R2.1), Communication (J5.4 J10.2)
I2C_SDA: ESP32 (IC1.33 R1.1), Communication (J5.2 J10.1)
IO4: ESP32 (IC1.26), Communication (J4.1)
IO16: ESP32 (IC1.27), Communication (J6.4)
IO17: ESP32 (IC1.28), Communication (J6.5)
IO32: ESP32 (IC1.8), Communication (J12.2)
IO33: ESP32 (IC1.9), Communication (J9.2)
IO34: ESP32 (IC1.6), Communication (J6.3)
IO35: ESP32 (IC1.7), Communication (J6.6)